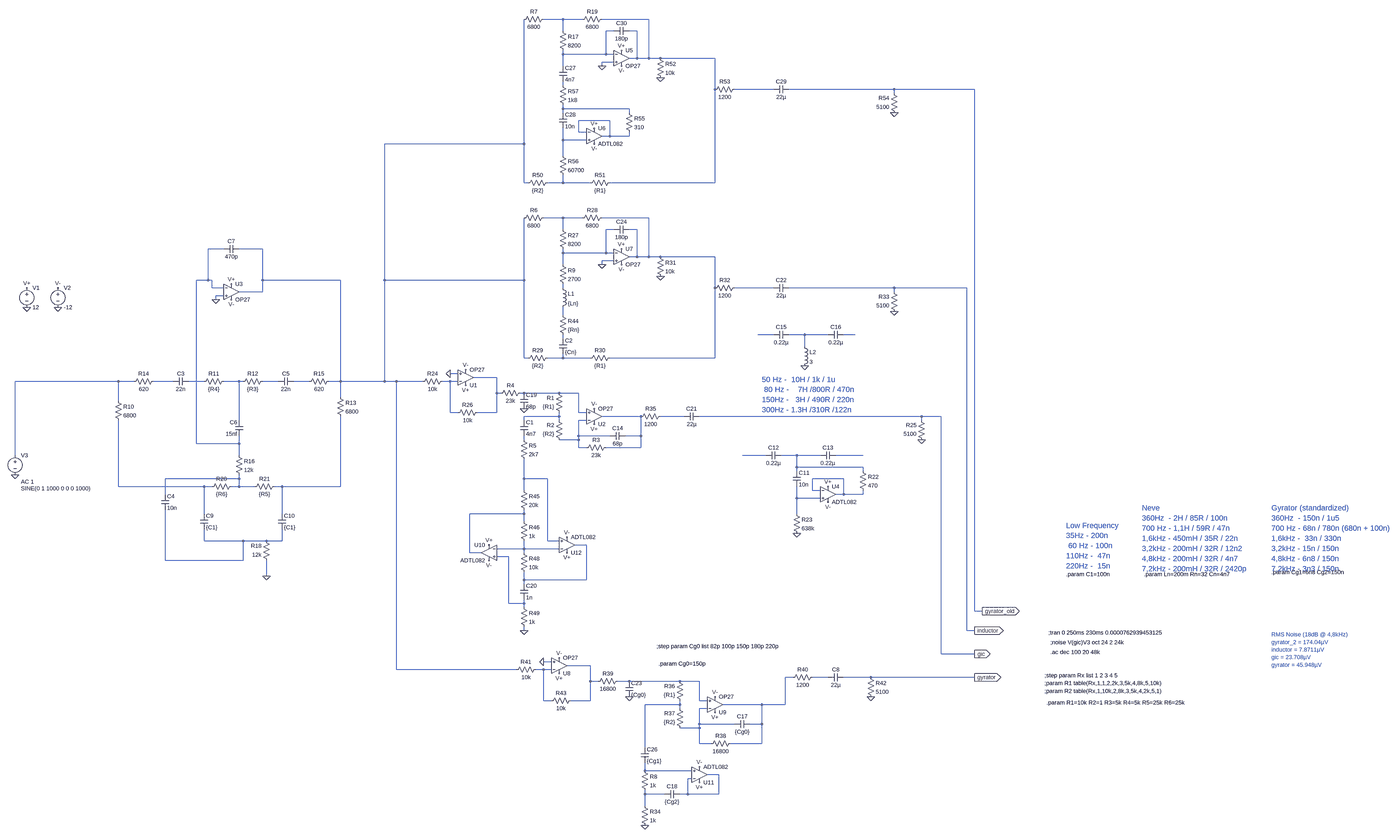
[diagram p0: schematic NYAN_1073_v2.asc, whole sheet]
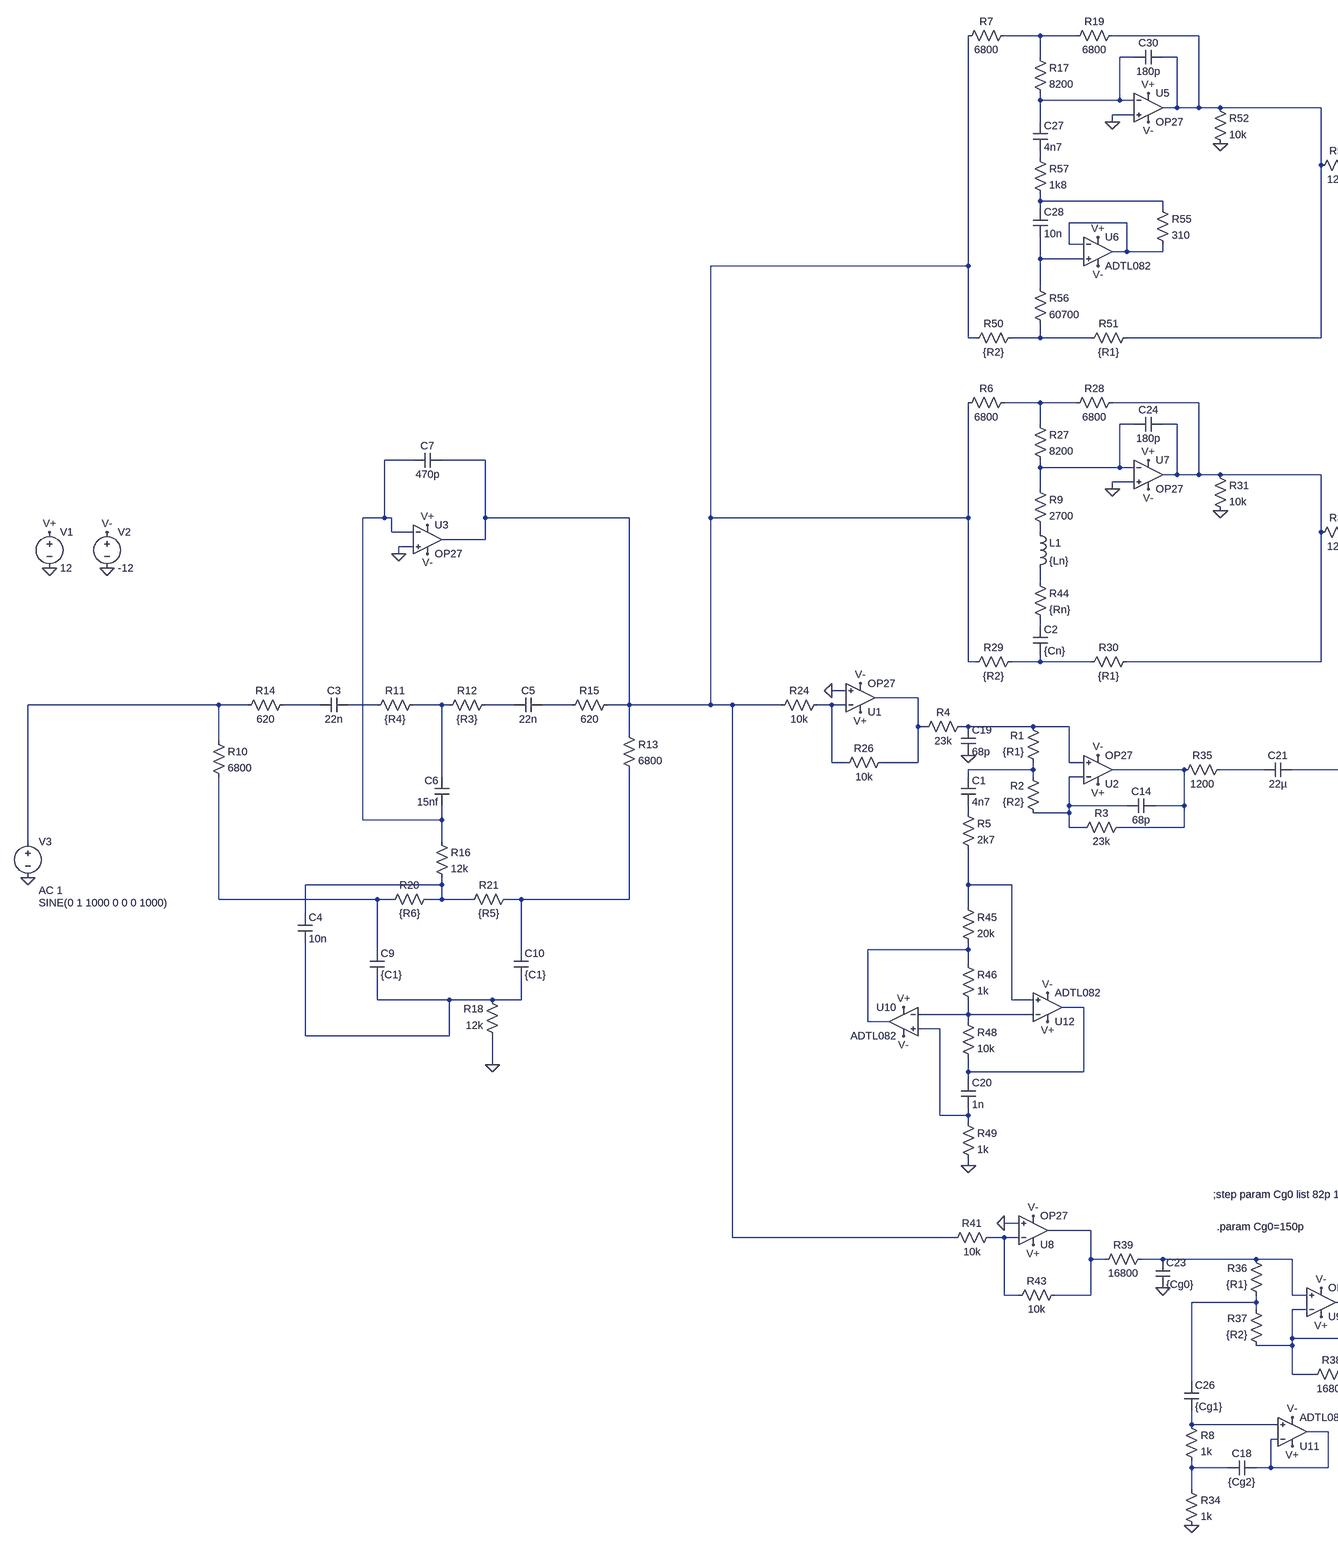
[diagram p1: schematic NYAN_1073_v2.asc, part, row 1 of 1, column 1 of 2]
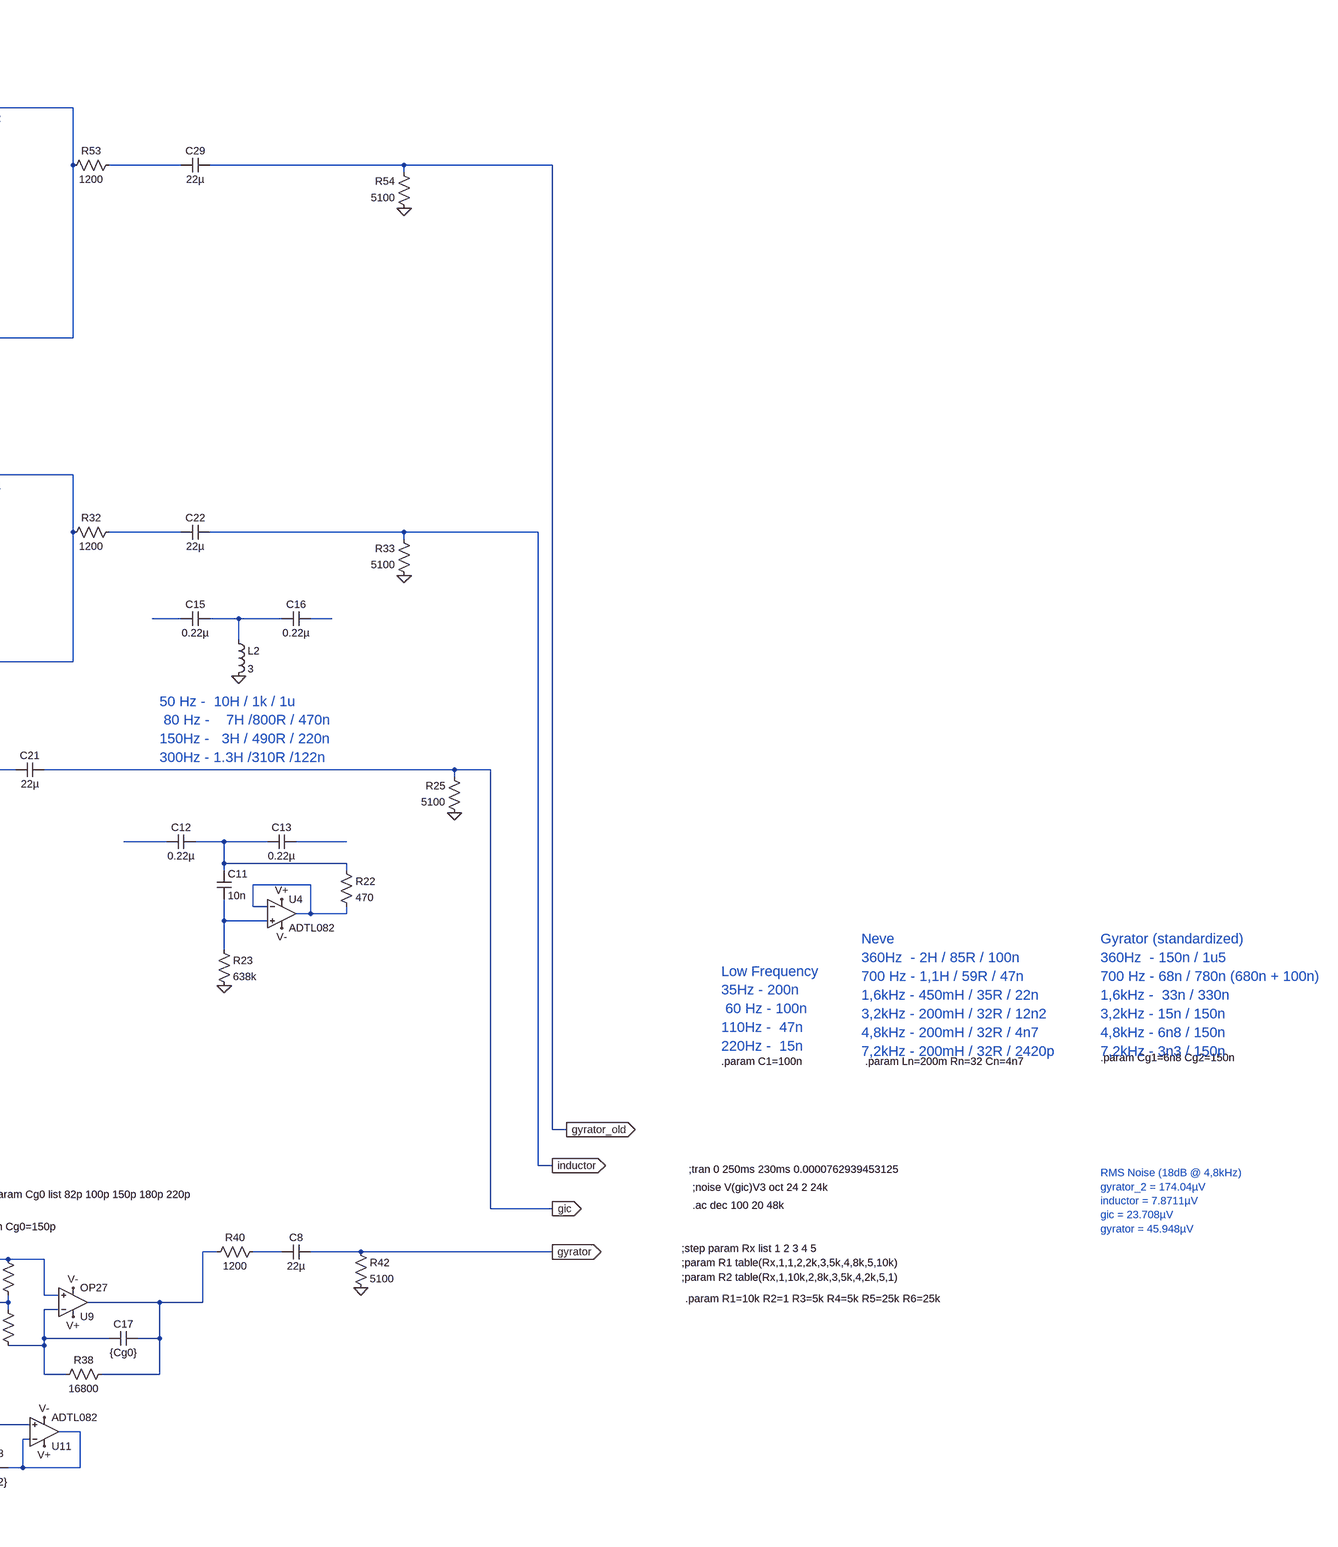
[diagram p2: schematic NYAN_1073_v2.asc, part, row 1 of 1, column 2 of 2]
NYAN_1073_v2.asc, the LTspice schematic file:
Version 4
SHEET 1 3984 2576
WIRE 288 -1104 208 -1104
WIRE 368 -1104 288 -1104
WIRE 640 -1104 448 -1104
WIRE 288 -1056 288 -1104
WIRE 496 -1056 464 -1056
WIRE 592 -1056 560 -1056
WIRE 288 -960 288 -976
WIRE 464 -960 464 -1056
WIRE 464 -960 288 -960
WIRE 496 -960 464 -960
WIRE 592 -944 592 -1056
WIRE 592 -944 560 -944
WIRE 640 -944 640 -1104
WIRE 640 -944 592 -944
WIRE 688 -944 640 -944
WIRE 912 -944 688 -944
WIRE 496 -928 448 -928
WIRE 288 -912 288 -960
WIRE 448 -912 448 -928
WIRE 288 -832 288 -848
WIRE 912 -816 912 -944
WIRE 1152 -816 992 -816
WIRE 1648 -816 1216 -816
WIRE 2176 -816 1648 -816
WIRE 1648 -800 1648 -816
WIRE 288 -736 288 -752
WIRE 560 -736 288 -736
WIRE 288 -720 288 -736
WIRE 560 -720 560 -736
WIRE 480 -688 352 -688
WIRE 352 -640 352 -688
WIRE 384 -640 352 -640
WIRE 480 -624 480 -688
WIRE 480 -624 448 -624
WIRE 560 -624 560 -640
WIRE 560 -624 480 -624
WIRE 288 -608 288 -656
WIRE 384 -608 288 -608
WIRE 128 -592 128 -1104
WIRE 128 -592 -448 -592
WIRE 288 -544 288 -608
WIRE 128 -432 128 -592
WIRE 144 -432 128 -432
WIRE 288 -432 288 -464
WIRE 288 -432 224 -432
WIRE 400 -432 288 -432
WIRE 912 -432 912 -816
WIRE 912 -432 480 -432
WIRE 288 -288 208 -288
WIRE 368 -288 288 -288
WIRE 640 -288 448 -288
WIRE 288 -240 288 -288
WIRE 496 -240 464 -240
WIRE 592 -240 560 -240
WIRE -1136 -160 -1200 -160
WIRE -976 -160 -1072 -160
WIRE 288 -144 288 -160
WIRE 464 -144 464 -240
WIRE 464 -144 288 -144
WIRE 496 -144 464 -144
WIRE 592 -128 592 -240
WIRE 592 -128 560 -128
WIRE 640 -128 640 -288
WIRE 640 -128 592 -128
WIRE 688 -128 640 -128
WIRE 912 -128 688 -128
WIRE 496 -112 448 -112
WIRE 288 -96 288 -144
WIRE 448 -96 448 -112
WIRE -1200 -32 -1200 -160
WIRE -1200 -32 -1248 -32
WIRE -1184 -32 -1200 -32
WIRE -976 -32 -976 -160
WIRE -656 -32 -976 -32
WIRE -448 -32 -448 -592
WIRE 128 -32 128 -288
WIRE 128 -32 -448 -32
WIRE -1184 0 -1184 -32
WIRE -1136 0 -1184 0
WIRE 288 0 288 -16
WIRE 912 0 912 -128
WIRE 1152 0 992 0
WIRE 1648 0 1216 0
WIRE 2144 0 1648 0
WIRE -976 16 -976 -32
WIRE -976 16 -1072 16
WIRE 1648 16 1648 0
WIRE -1136 32 -1168 32
WIRE -1168 48 -1168 32
WIRE 288 112 288 80
WIRE 1152 192 1088 192
WIRE 1280 192 1216 192
WIRE 1376 192 1280 192
WIRE 1488 192 1440 192
WIRE 288 208 288 192
WIRE 1280 240 1280 192
WIRE 128 288 128 -32
WIRE 144 288 128 288
WIRE 288 288 288 272
WIRE 288 288 224 288
WIRE 400 288 288 288
WIRE 912 288 912 0
WIRE 912 288 480 288
WIRE -144 352 -176 352
WIRE 16 368 -80 368
WIRE -1568 384 -2064 384
WIRE -1504 384 -1568 384
WIRE -1344 384 -1424 384
WIRE -1216 384 -1280 384
WIRE -1072 384 -1136 384
WIRE -1056 384 -1072 384
WIRE -912 384 -976 384
WIRE -784 384 -848 384
WIRE -656 384 -656 -32
WIRE -656 384 -704 384
WIRE -448 384 -448 -32
WIRE -448 384 -656 384
WIRE -400 384 -448 384
WIRE -288 384 -400 384
WIRE -176 384 -208 384
WIRE -144 384 -176 384
WIRE 16 432 16 368
WIRE 32 432 16 432
WIRE 128 432 112 432
WIRE 272 432 128 432
WIRE 352 432 272 432
WIRE -656 448 -656 384
WIRE -1568 464 -1568 384
WIRE -176 512 -176 384
WIRE -144 512 -176 512
WIRE 16 512 16 432
WIRE 16 512 -64 512
WIRE 352 512 352 432
WIRE 384 512 352 512
WIRE 272 528 272 512
WIRE 272 528 128 528
WIRE 608 528 448 528
WIRE 784 528 688 528
WIRE 1760 528 848 528
WIRE 1840 528 1760 528
WIRE -1072 544 -1072 384
WIRE 128 544 128 528
WIRE 272 544 272 528
WIRE 384 544 352 544
WIRE 1760 544 1760 528
WIRE 352 608 352 544
WIRE 480 608 352 608
WIRE 608 608 608 528
WIRE 608 608 544 608
WIRE 128 624 128 608
WIRE 352 624 352 608
WIRE 352 624 272 624
WIRE -1248 640 -1248 -32
WIRE -1072 640 -1072 608
WIRE -1072 640 -1248 640
WIRE 352 656 352 624
WIRE 384 656 352 656
WIRE 608 656 608 608
WIRE 608 656 464 656
WIRE -2064 688 -2064 384
WIRE -1072 688 -1072 640
WIRE 1120 688 1024 688
WIRE 1248 688 1184 688
WIRE 1344 688 1248 688
WIRE 1520 688 1408 688
WIRE 1248 736 1248 688
WIRE 1520 736 1248 736
WIRE 1248 752 1248 736
WIRE 1520 752 1520 736
WIRE -1072 784 -1072 768
WIRE -1072 784 -1376 784
WIRE 128 784 128 704
WIRE 224 784 128 784
WIRE 1440 784 1312 784
WIRE -1568 816 -1568 544
WIRE -1216 816 -1568 816
WIRE -1184 816 -1216 816
WIRE -1072 816 -1072 784
WIRE -1072 816 -1104 816
WIRE -1008 816 -1072 816
WIRE -896 816 -928 816
WIRE -656 816 -656 528
WIRE -656 816 -896 816
WIRE 128 832 128 784
WIRE 1312 832 1312 784
WIRE 1344 832 1312 832
WIRE -1376 848 -1376 784
WIRE 1440 848 1440 784
WIRE 1440 848 1408 848
WIRE 1520 848 1520 832
WIRE 1520 848 1440 848
WIRE 1248 864 1248 816
WIRE 1344 864 1248 864
WIRE -1216 928 -1216 816
WIRE -896 928 -896 816
WIRE 128 928 128 912
WIRE 128 928 -96 928
WIRE 1248 928 1248 864
WIRE 128 960 128 928
WIRE -1216 1040 -1216 992
WIRE -1056 1040 -1216 1040
WIRE -960 1040 -1056 1040
WIRE -896 1040 -896 992
WIRE -896 1040 -960 1040
WIRE 224 1040 224 784
WIRE 272 1040 224 1040
WIRE 384 1056 336 1056
WIRE 128 1072 128 1040
WIRE 128 1072 16 1072
WIRE 272 1072 128 1072
WIRE -96 1088 -96 928
WIRE -48 1088 -96 1088
WIRE 128 1088 128 1072
WIRE 64 1104 16 1104
WIRE -1376 1120 -1376 912
WIRE -1056 1120 -1056 1040
WIRE -1056 1120 -1376 1120
WIRE -960 1184 -960 1120
WIRE 128 1200 128 1168
WIRE 384 1200 384 1056
WIRE 384 1200 128 1200
WIRE 128 1216 128 1200
WIRE 64 1296 64 1104
WIRE 128 1296 128 1280
WIRE 128 1296 64 1296
WIRE 128 1312 128 1296
WIRE 2176 1328 2176 -816
WIRE 2208 1328 2176 1328
WIRE 128 1408 128 1392
WIRE 2144 1408 2144 0
WIRE 2176 1408 2144 1408
WIRE 1840 1504 1840 528
WIRE 2176 1504 1840 1504
WIRE 240 1536 208 1536
WIRE 400 1552 304 1552
WIRE -400 1568 -400 384
WIRE 96 1568 -400 1568
WIRE 208 1568 176 1568
WIRE 240 1568 208 1568
WIRE 1232 1600 1200 1600
WIRE 1376 1600 1312 1600
WIRE 1552 1600 1440 1600
WIRE 2176 1600 1552 1600
WIRE 400 1616 400 1552
WIRE 432 1616 400 1616
WIRE 560 1616 512 1616
WIRE 768 1616 560 1616
WIRE 848 1616 768 1616
WIRE 208 1696 208 1568
WIRE 240 1696 208 1696
WIRE 400 1696 400 1616
WIRE 400 1696 320 1696
WIRE 848 1696 848 1616
WIRE 880 1696 848 1696
WIRE 768 1712 768 1696
WIRE 768 1712 624 1712
WIRE 1104 1712 944 1712
WIRE 1200 1712 1200 1600
WIRE 1200 1712 1104 1712
WIRE 768 1728 768 1712
WIRE 880 1728 848 1728
WIRE 848 1792 848 1728
WIRE 992 1792 848 1792
WIRE 1104 1792 1104 1712
WIRE 1104 1792 1056 1792
WIRE 848 1808 848 1792
WIRE 848 1808 768 1808
WIRE 848 1872 848 1808
WIRE 896 1872 848 1872
WIRE 1104 1872 1104 1792
WIRE 1104 1872 976 1872
WIRE 624 1888 624 1712
WIRE 624 1984 624 1952
WIRE 816 1984 624 1984
WIRE 928 2000 880 2000
WIRE 816 2016 800 2016
WIRE 624 2080 624 2064
WIRE 704 2080 624 2080
WIRE 800 2080 800 2016
WIRE 800 2080 768 2080
WIRE 928 2080 928 2000
WIRE 928 2080 800 2080
WIRE 624 2128 624 2080
FLAG -2016 80 0
FLAG -2016 0 V+
FLAG -1888 80 0
FLAG -1888 0 V-
FLAG -2064 768 0
FLAG -1168 48 0
FLAG -1104 -16 V+
FLAG -1104 48 V-
FLAG -960 1184 0
FLAG 1376 816 V+
FLAG 1376 880 V-
FLAG 1248 1008 0
FLAG 1760 624 0
FLAG 2176 1504 gic
IOPIN 2176 1504 Out
FLAG 416 560 V+
FLAG 416 496 V-
FLAG -112 400 V+
FLAG -112 336 V-
FLAG -176 352 0
FLAG 448 -96 0
FLAG 528 -160 V+
FLAG 528 -96 V-
FLAG 688 -48 0
FLAG 2176 1408 inductor
IOPIN 2176 1408 Out
FLAG 1648 96 0
FLAG 1280 320 0
FLAG 2176 1600 gyrator
IOPIN 2176 1600 Out
FLAG 912 1744 V+
FLAG 912 1680 V-
FLAG 272 1584 V+
FLAG 272 1520 V-
FLAG 208 1536 0
FLAG 848 2032 V+
FLAG 848 1968 V-
FLAG 128 496 0
FLAG -16 1056 V+
FLAG -16 1120 V-
FLAG 304 1088 V+
FLAG 304 1024 V-
FLAG 128 1408 0
FLAG 448 -912 0
FLAG 528 -976 V+
FLAG 528 -912 V-
FLAG 688 -864 0
FLAG 2208 1328 gyrator_old
IOPIN 2208 1328 Out
FLAG 1648 -720 0
FLAG 416 -656 V+
FLAG 416 -592 V-
FLAG 624 2208 0
FLAG 1552 1680 0
FLAG 560 1680 0
SYMBOL voltage -2016 -16 R0
WINDOW 123 0 0 Left 0
WINDOW 39 0 0 Left 0
SYMATTR InstName V1
SYMATTR Value 12
SYMBOL voltage -1888 -16 R0
WINDOW 123 0 0 Left 0
WINDOW 39 0 0 Left 0
SYMATTR InstName V2
SYMATTR Value -12
SYMBOL voltage -2064 672 R0
WINDOW 3 24 152 Left 2
WINDOW 123 24 124 Left 2
WINDOW 39 0 0 Left 0
SYMATTR Value SINE(0 1 1000 0 0 0 1000)
SYMATTR Value2 AC 1
SYMATTR InstName V3
SYMBOL res -1120 368 R90
WINDOW 0 0 56 VBottom 2
WINDOW 3 32 56 VTop 2
SYMATTR InstName R11
SYMATTR Value {R4}
SYMBOL res -960 368 R90
WINDOW 0 0 56 VBottom 2
WINDOW 3 32 56 VTop 2
SYMATTR InstName R12
SYMATTR Value {R3}
SYMBOL cap -1280 368 R90
WINDOW 0 0 32 VBottom 2
WINDOW 3 32 32 VTop 2
SYMATTR InstName C3
SYMATTR Value 22n
SYMBOL cap -848 368 R90
WINDOW 0 0 32 VBottom 2
WINDOW 3 32 32 VTop 2
SYMATTR InstName C5
SYMATTR Value 22n
SYMBOL cap -1056 608 R180
WINDOW 0 24 56 Left 2
WINDOW 3 24 8 Left 2
SYMATTR InstName C6
SYMATTR Value 15nf
SYMBOL res -1584 448 R0
SYMATTR InstName R10
SYMATTR Value 6800
SYMATTR SpiceLine tol=1 pwr=0.25
SYMBOL res -672 432 R0
SYMATTR InstName R13
SYMATTR Value 6800
SYMBOL res -1408 368 R90
WINDOW 0 0 56 VBottom 2
WINDOW 3 32 56 VTop 2
SYMATTR InstName R14
SYMATTR Value 620
SYMBOL res -688 368 R90
WINDOW 0 0 56 VBottom 2
WINDOW 3 32 56 VTop 2
SYMATTR InstName R15
SYMATTR Value 620
SYMBOL res -1088 672 R0
SYMATTR InstName R16
SYMATTR Value 12k
SYMBOL res -944 1136 R180
WINDOW 0 36 76 Left 2
WINDOW 3 36 40 Left 2
SYMATTR InstName R18
SYMATTR Value 12k
SYMBOL cap -1392 848 R0
SYMATTR InstName C4
SYMATTR Value 10n
SYMBOL res -1088 800 R90
WINDOW 0 0 56 VBottom 2
WINDOW 3 32 56 VTop 2
SYMATTR InstName R20
SYMATTR Value {R6}
SYMBOL res -912 800 R90
WINDOW 0 0 56 VBottom 2
WINDOW 3 32 56 VTop 2
SYMATTR InstName R21
SYMATTR Value {R5}
SYMBOL cap -1232 928 R0
SYMATTR InstName C9
SYMATTR Value {C1}
SYMBOL cap -912 928 R0
SYMATTR InstName C10
SYMATTR Value {C1}
SYMBOL Opamps\\ADTL082 1376 784 R0
SYMATTR InstName U4
SYMBOL cap 1232 752 R0
SYMATTR InstName C11
SYMATTR Value 10n
SYMATTR SpiceLine V=63
SYMBOL res 1504 736 R0
SYMATTR InstName R22
SYMATTR Value 470
SYMATTR SpiceLine tol=1 pwr=0.25
SYMBOL res 1232 912 R0
SYMATTR InstName R23
SYMATTR Value 638k
SYMATTR SpiceLine tol=1 pwr=0.25
SYMBOL res 1776 640 R180
WINDOW 0 36 76 Left 2
WINDOW 3 36 40 Left 2
SYMATTR InstName R25
SYMATTR Value 5100
SYMBOL cap 1184 672 R90
WINDOW 0 0 32 VBottom 2
WINDOW 3 32 32 VTop 2
SYMATTR InstName C12
SYMATTR Value 0.22µ
SYMBOL cap 1408 672 R90
WINDOW 0 0 32 VBottom 2
WINDOW 3 32 32 VTop 2
SYMATTR InstName C13
SYMATTR Value 0.22µ
SYMBOL res 704 512 R90
WINDOW 0 0 56 VBottom 2
WINDOW 3 32 56 VTop 2
SYMATTR InstName R35
SYMATTR Value 1200
SYMBOL res 288 528 R180
WINDOW 0 36 76 Left 2
WINDOW 3 36 40 Left 2
SYMATTR InstName R1
SYMATTR Value {R1}
SYMATTR SpiceLine tol=1 pwr=0.25
SYMBOL res 288 640 R180
WINDOW 0 36 76 Left 2
WINDOW 3 36 40 Left 2
SYMATTR InstName R2
SYMATTR Value {R2}
SYMATTR SpiceLine tol=1 pwr=0.25
SYMBOL res 480 640 R90
WINDOW 0 0 56 VBottom 2
WINDOW 3 32 56 VTop 2
SYMATTR InstName R3
SYMATTR Value 23k
SYMBOL res 128 416 R90
WINDOW 0 0 56 VBottom 2
WINDOW 3 32 56 VTop 2
SYMATTR InstName R4
SYMATTR Value 23k
SYMBOL cap 112 544 R0
SYMATTR InstName C1
SYMATTR Value 4n7
SYMATTR SpiceLine V=63
SYMBOL OpAmps\\OP27 -112 432 M180
SYMATTR InstName U1
SYMBOL OpAmps\\OP27 416 592 M180
SYMATTR InstName U2
SYMBOL res -192 368 R90
WINDOW 0 0 56 VBottom 2
WINDOW 3 32 56 VTop 2
SYMATTR InstName R24
SYMATTR Value 10k
SYMBOL res -48 496 R90
WINDOW 0 0 56 VBottom 2
WINDOW 3 32 56 VTop 2
SYMATTR InstName R26
SYMATTR Value 10k
SYMBOL OpAmps\\OP27 -1104 -48 R0
SYMATTR InstName U3
SYMBOL res 224 -304 R90
WINDOW 0 0 56 VBottom 2
WINDOW 3 32 56 VTop 2
SYMATTR InstName R6
SYMATTR Value 6800
SYMATTR SpiceLine tol=1 pwr=0.25
SYMBOL res 272 -112 R0
SYMATTR InstName R9
SYMATTR Value 2700
SYMATTR SpiceLine tol=1 pwr=0.25
SYMBOL res 272 -256 R0
SYMATTR InstName R27
SYMATTR Value 8200
SYMATTR SpiceLine tol=1 pwr=0.25
SYMBOL cap 272 208 R0
SYMATTR InstName C2
SYMATTR Value {Cn}
SYMATTR SpiceLine V=63
SYMBOL res 464 -304 R90
WINDOW 0 0 56 VBottom 2
WINDOW 3 32 56 VTop 2
SYMATTR InstName R28
SYMATTR Value 6800
SYMATTR SpiceLine tol=1 pwr=0.25
SYMBOL res 240 272 R90
WINDOW 0 0 56 VBottom 2
WINDOW 3 32 56 VTop 2
SYMATTR InstName R29
SYMATTR Value {R2}
SYMATTR SpiceLine tol=1 pwr=0.25
SYMBOL res 496 272 R90
WINDOW 0 0 56 VBottom 2
WINDOW 3 32 56 VTop 2
SYMATTR InstName R30
SYMATTR Value {R1}
SYMATTR SpiceLine tol=1 pwr=0.25
SYMBOL res 672 -144 R0
SYMATTR InstName R31
SYMATTR Value 10k
SYMBOL res 1008 -16 R90
WINDOW 0 0 56 VBottom 2
WINDOW 3 32 56 VTop 2
SYMATTR InstName R32
SYMATTR Value 1200
SYMBOL ind 272 -16 R0
SYMATTR InstName L1
SYMATTR Value {Ln}
SYMATTR SpiceLine Rser=0
SYMBOL OpAmps\\OP27 528 -192 R0
SYMATTR InstName U7
SYMBOL res 1664 112 R180
WINDOW 0 36 76 Left 2
WINDOW 3 36 40 Left 2
SYMATTR InstName R33
SYMATTR Value 5100
SYMBOL cap 1216 176 R90
WINDOW 0 0 32 VBottom 2
WINDOW 3 32 32 VTop 2
SYMATTR InstName C15
SYMATTR Value 0.22µ
SYMBOL cap 1440 176 R90
WINDOW 0 0 32 VBottom 2
WINDOW 3 32 32 VTop 2
SYMATTR InstName C16
SYMATTR Value 0.22µ
SYMBOL ind 1264 224 R0
SYMATTR InstName L2
SYMATTR Value 3
SYMATTR SpiceLine Rser=490
SYMBOL cap -1072 -176 R90
WINDOW 0 0 32 VBottom 2
WINDOW 3 32 32 VTop 2
SYMATTR InstName C7
SYMATTR Value 470p
SYMBOL res 784 1712 R180
WINDOW 0 36 76 Left 2
WINDOW 3 36 40 Left 2
SYMATTR InstName R36
SYMATTR Value {R1}
SYMATTR SpiceLine tol=1 pwr=0.25
SYMBOL res 784 1824 R180
WINDOW 0 36 76 Left 2
WINDOW 3 36 40 Left 2
SYMATTR InstName R37
SYMATTR Value {R2}
SYMATTR SpiceLine tol=1 pwr=0.25
SYMBOL res 992 1856 R90
WINDOW 0 0 56 VBottom 2
WINDOW 3 32 56 VTop 2
SYMATTR InstName R38
SYMATTR Value 16800
SYMBOL res 528 1600 R90
WINDOW 0 0 56 VBottom 2
WINDOW 3 32 56 VTop 2
SYMATTR InstName R39
SYMATTR Value 16800
SYMBOL OpAmps\\OP27 272 1616 M180
SYMATTR InstName U8
SYMBOL OpAmps\\OP27 912 1776 M180
SYMATTR InstName U9
SYMBOL res 192 1552 R90
WINDOW 0 0 56 VBottom 2
WINDOW 3 32 56 VTop 2
SYMATTR InstName R41
SYMATTR Value 10k
SYMBOL res 336 1680 R90
WINDOW 0 0 56 VBottom 2
WINDOW 3 32 56 VTop 2
SYMATTR InstName R43
SYMATTR Value 10k
SYMBOL Opamps\\ADTL082 848 2064 M180
SYMATTR InstName U11
SYMBOL res 112 608 R0
SYMATTR InstName R5
SYMATTR Value 2k7
SYMBOL cap 848 512 R90
WINDOW 0 0 32 VBottom 2
WINDOW 3 32 32 VTop 2
SYMATTR InstName C21
SYMATTR Value 22µ
SYMBOL cap 1216 -16 R90
WINDOW 0 0 32 VBottom 2
WINDOW 3 32 32 VTop 2
SYMATTR InstName C22
SYMATTR Value 22µ
SYMBOL Opamps\\ADTL082 -16 1024 M0
SYMATTR InstName U10
SYMBOL Opamps\\ADTL082 304 1120 M180
SYMATTR InstName U12
SYMBOL res 112 816 R0
SYMATTR InstName R45
SYMATTR Value 20k
SYMBOL res 112 944 R0
SYMATTR InstName R46
SYMATTR Value 1k
SYMBOL res 112 1072 R0
SYMATTR InstName R48
SYMATTR Value 10k
SYMBOL cap 112 1216 R0
SYMATTR InstName C20
SYMATTR Value 1n
SYMBOL res 112 1296 R0
SYMATTR InstName R49
SYMATTR Value 1k
SYMBOL res 224 -1120 R90
WINDOW 0 0 56 VBottom 2
WINDOW 3 32 56 VTop 2
SYMATTR InstName R7
SYMATTR Value 6800
SYMATTR SpiceLine tol=1 pwr=0.25
SYMBOL res 272 -1072 R0
SYMATTR InstName R17
SYMATTR Value 8200
SYMATTR SpiceLine tol=1 pwr=0.25
SYMBOL res 464 -1120 R90
WINDOW 0 0 56 VBottom 2
WINDOW 3 32 56 VTop 2
SYMATTR InstName R19
SYMATTR Value 6800
SYMATTR SpiceLine tol=1 pwr=0.25
SYMBOL res 240 -448 R90
WINDOW 0 0 56 VBottom 2
WINDOW 3 32 56 VTop 2
SYMATTR InstName R50
SYMATTR Value {R2}
SYMATTR SpiceLine tol=1 pwr=0.25
SYMBOL res 496 -448 R90
WINDOW 0 0 56 VBottom 2
WINDOW 3 32 56 VTop 2
SYMATTR InstName R51
SYMATTR Value {R1}
SYMATTR SpiceLine tol=1 pwr=0.25
SYMBOL res 672 -960 R0
SYMATTR InstName R52
SYMATTR Value 10k
SYMBOL res 1008 -832 R90
WINDOW 0 0 56 VBottom 2
WINDOW 3 32 56 VTop 2
SYMATTR InstName R53
SYMATTR Value 1200
SYMBOL OpAmps\\OP27 528 -1008 R0
SYMATTR InstName U5
SYMBOL res 1664 -704 R180
WINDOW 0 36 76 Left 2
WINDOW 3 36 40 Left 2
SYMATTR InstName R54
SYMATTR Value 5100
SYMBOL cap 1216 -832 R90
WINDOW 0 0 32 VBottom 2
WINDOW 3 32 32 VTop 2
SYMATTR InstName C29
SYMATTR Value 22µ
SYMBOL cap 560 -1072 R90
WINDOW 0 0 32 VBottom 2
WINDOW 3 32 32 VTop 2
SYMATTR InstName C30
SYMATTR Value 180p
SYMBOL cap 272 -912 R0
SYMATTR InstName C27
SYMATTR Value 4n7
SYMATTR SpiceLine V=63
SYMBOL Opamps\\ADTL082 416 -688 R0
SYMATTR InstName U6
SYMBOL cap 272 -720 R0
SYMATTR InstName C28
SYMATTR Value 10n
SYMATTR SpiceLine V=63
SYMBOL res 544 -736 R0
SYMATTR InstName R55
SYMATTR Value 310
SYMATTR SpiceLine tol=1 pwr=0.25
SYMBOL res 272 -560 R0
SYMATTR InstName R56
SYMATTR Value 60700
SYMATTR SpiceLine tol=1 pwr=0.25
SYMBOL res 272 -848 R0
SYMATTR InstName R57
SYMATTR Value 1k8
SYMBOL cap 544 592 R90
WINDOW 0 0 32 VBottom 2
WINDOW 3 32 32 VTop 2
SYMATTR InstName C14
SYMATTR Value 68p
SYMBOL cap 112 432 R0
SYMATTR InstName C19
SYMATTR Value 68p
SYMBOL cap 768 2064 R90
WINDOW 0 0 32 VBottom 2
WINDOW 3 32 32 VTop 2
SYMATTR InstName C18
SYMATTR Value {Cg2}
SYMBOL res 608 1968 R0
SYMATTR InstName R8
SYMATTR Value 1k
SYMBOL res 608 2112 R0
SYMATTR InstName R34
SYMATTR Value 1k
SYMBOL cap 608 1888 R0
SYMATTR InstName C26
SYMATTR Value {Cg1}
SYMBOL res 1328 1584 R90
WINDOW 0 0 56 VBottom 2
WINDOW 3 32 56 VTop 2
SYMATTR InstName R40
SYMATTR Value 1200
SYMBOL cap 1440 1584 R90
WINDOW 0 0 32 VBottom 2
WINDOW 3 32 32 VTop 2
SYMATTR InstName C8
SYMATTR Value 22µ
SYMBOL res 1536 1584 R0
SYMATTR InstName R42
SYMATTR Value 5100
SYMBOL cap 560 -256 R90
WINDOW 0 0 32 VBottom 2
WINDOW 3 32 32 VTop 2
SYMATTR InstName C24
SYMATTR Value 180p
SYMBOL res 272 96 R0
SYMATTR InstName R44
SYMATTR Value {Rn}
SYMBOL cap 1056 1776 R90
WINDOW 0 0 32 VBottom 2
WINDOW 3 32 32 VTop 2
SYMATTR InstName C17
SYMATTR Value {Cg0}
SYMBOL cap 544 1616 R0
SYMATTR InstName C23
SYMATTR Value {Cg0}
TEXT 2496 1496 Left 2 !.ac dec 100 20 48k
TEXT 2488 1416 Left 2 !;tran 0 250ms 230ms 0.0000762939453125
TEXT 2496 1456 Left 2 !;noise V(gic)V3 oct 24 2 24k
TEXT 2560 976 Left 3 ;Low Frequency\n35Hz - 200n\n 60 Hz - 100n\n110Hz -  47n\n220Hz -  15n
TEXT 1104 376 Left 3 ;50 Hz -  10H / 1k / 1u\n 80 Hz -    7H /800R / 470n\n150Hz -   3H / 490R / 220n\n300Hz - 1.3H /310R /122n
TEXT 2472 1592 Left 2 !;step param Rx list 1 2 3 4 5
TEXT 2472 1624 Left 2 !;param R1 table(Rx,1,1,2,2k,3,5k,4,8k,5,10k)
TEXT 2472 1656 Left 2 !;param R2 table(Rx,1,10k,2,8k,3,5k,4,2k,5,1)
TEXT 2880 1176 Left 2 !.param Ln=200m Rn=32 Cn=4n7
TEXT 2872 904 Left 3 ;Neve\n360Hz  - 2H / 85R / 100n\n700 Hz - 1,1H / 59R / 47n\n1,6kHz - 450mH / 35R / 22n\n3,2kHz - 200mH / 32R / 12n2\n4,8kHz - 200mH / 32R / 4n7\n7,2kHz - 200mH / 32R / 2420p
TEXT 3432 1168 Left 2 !.param Cg1=6n8 Cg2=150n
TEXT 2480 1704 Left 2 !.param R1=10k R2=1 R3=5k R4=5k R5=25k R6=25k
TEXT 680 1544 Left 2 !.param Cg0=150p
TEXT 3432 1424 Left 2 ;RMS Noise (18dB @ 4,8kHz)\ngyrator_2 = 174.04µV\ninductor = 7.8711µV\ngic = 23.708µV\ngyrator = 45.948µV
TEXT 2560 1176 Left 2 !.param C1=100n
TEXT 3432 904 Left 3 ;Gyrator (standardized)\n360Hz  - 150n / 1u5\n700 Hz - 68n / 780n (680n + 100n)\n1,6kHz -  33n / 330n\n3,2kHz - 15n / 150n\n4,8kHz - 6n8 / 150n\n7,2kHz - 3n3 / 150n
TEXT 672 1472 Left 2 !;step param Cg0 list 82p 100p 150p 180p 220p

The netlist it stands for:
* NYAN_1073_v2.asc
V1 V+ 0 12
V2 V- 0 -12
V3 N024 0 SINE(0 1 1000 0 0 0 1000) AC 1
R11 N027 N026 {R4}
R12 N028 N027 {R3}
C3 N026 N025 22n
C5 N029 N028 22n
C6 N014 N027 15nf
R10 N024 N043 6800 tol=1 pwr=0.25
R13 N009 N044 6800
R14 N025 N024 620
R15 N009 N029 620
R16 N014 N040 12k
R18 0 N047 12k
C4 N040 N047 10n
R20 N040 N043 {R6}
R21 N044 N040 {R5}
C9 N043 N047 {C1}
C10 N044 N047 {C1}
XU4 N045 N042 V+ V- N042 ADTL082  ; pins In+ In- V+ V- OUT
C11 N038 N045 10n V=63
R22 N038 N042 470 tol=1 pwr=0.25
R23 N045 0 638k tol=1 pwr=0.25
R25 0 gic 5100
C12 N038 N037 0.22µ
C13 N039 N038 0.22µ
R35 N034 N033 1200
R1 N032 N031 {R1} tol=1 pwr=0.25
R2 N035 N032 {R2} tol=1 pwr=0.25
R3 N033 N035 23k
R4 N031 N023 23k
C1 N032 N036 4n7 V=63
XU1 0 N030 V+ V- N023 OP27  ; pins In+ In- V+ V- OUT
XU2 N031 N035 V+ V- N033 OP27  ; pins In+ In- V+ V- OUT
R24 N030 N009 10k
R26 N023 N030 10k
XU3 0 N014 V+ V- N009 OP27  ; pins In+ In- V+ V- OUT
R6 N011 N009 6800 tol=1 pwr=0.25
R9 N013 N015 2700 tol=1 pwr=0.25
R27 N011 N013 8200 tol=1 pwr=0.25
C2 N021 N022 {Cn} V=63
R28 N012 N011 6800 tol=1 pwr=0.25
R29 N022 N009 {R2} tol=1 pwr=0.25
R30 N012 N022 {R1} tol=1 pwr=0.25
R31 N012 0 10k
R32 N016 N012 1200
L1 N015 N017 {Ln} Rser=0
XU7 0 N013 V+ V- N012 OP27  ; pins In+ In- V+ V- OUT
R33 0 inductor 5100
C15 N019 N018 0.22µ
C16 N020 N019 0.22µ
L2 N019 0 3 Rser=490
C7 N009 N014 470p
R36 N056 N055 {R1} tol=1 pwr=0.25
R37 N057 N056 {R2} tol=1 pwr=0.25
R38 N053 N057 16800
R39 N055 N051 16800
XU8 0 N052 V+ V- N051 OP27  ; pins In+ In- V+ V- OUT
XU9 N055 N057 V+ V- N053 OP27  ; pins In+ In- V+ V- OUT
R41 N052 N009 10k
R43 N051 N052 10k
XU11 N058 N059 V+ V- N059 ADTL082  ; pins In+ In- V+ V- OUT
R5 N036 N041 2k7
C21 gic N034 22µ
C22 inductor N016 22µ
XU10 N050 N049 V+ V- N046 ADTL082  ; pins In+ In- V+ V- OUT
XU12 N041 N049 V+ V- N048 ADTL082  ; pins In+ In- V+ V- OUT
R45 N041 N046 20k
R46 N046 N049 1k
R48 N049 N048 10k
C20 N048 N050 1n
R49 N050 0 1k
R7 N001 N009 6800 tol=1 pwr=0.25
R17 N001 N003 8200 tol=1 pwr=0.25
R19 N002 N001 6800 tol=1 pwr=0.25
R50 N010 N009 {R2} tol=1 pwr=0.25
R51 N002 N010 {R1} tol=1 pwr=0.25
R52 N002 0 10k
R53 N005 N002 1200
XU5 0 N003 V+ V- N002 OP27  ; pins In+ In- V+ V- OUT
R54 0 gyrator_old 5100
C29 gyrator_old N005 22µ
C30 N002 N003 180p
C27 N003 N004 4n7 V=63
XU6 N008 N007 V+ V- N007 ADTL082  ; pins In+ In- V+ V- OUT
C28 N006 N008 10n V=63
R55 N006 N007 310 tol=1 pwr=0.25
R56 N008 N010 60700 tol=1 pwr=0.25
R57 N004 N006 1k8
C14 N033 N035 68p
C19 N031 0 68p
C18 N059 N060 {Cg2}
R8 N058 N060 1k
R34 N060 0 1k
C26 N056 N058 {Cg1}
R40 N054 N053 1200
C8 gyrator N054 22µ
R42 gyrator 0 5100
C24 N012 N013 180p
R44 N017 N021 {Rn}
C17 N053 N057 {Cg0}
C23 N055 0 {Cg0}
.ac dec 100 20 48k
;tran 0 250ms 230ms 0.0000762939453125
;noise V(gic)V3 oct 24 2 24k
* Low Frequency
* 35Hz - 200n
*  60 Hz - 100n
* 110Hz -  47n
* 220Hz -  15n
* 50 Hz -  10H / 1k / 1u
*  80 Hz -    7H /800R / 470n
* 150Hz -   3H / 490R / 220n
* 300Hz - 1.3H /310R /122n
;step param Rx list 1 2 3 4 5
;param R1 table(Rx,1,1,2,2k,3,5k,4,8k,5,10k)
;param R2 table(Rx,1,10k,2,8k,3,5k,4,2k,5,1)
.param Ln=200m Rn=32 Cn=4n7
* Neve
* 360Hz  - 2H / 85R / 100n
* 700 Hz - 1,1H / 59R / 47n
* 1,6kHz - 450mH / 35R / 22n
* 3,2kHz - 200mH / 32R / 12n2
* 4,8kHz - 200mH / 32R / 4n7
* 7,2kHz - 200mH / 32R / 2420p
.param Cg1=6n8 Cg2=150n
.param R1=10k R2=1 R3=5k R4=5k R5=25k R6=25k
.param Cg0=150p
* RMS Noise (18dB @ 4,8kHz)
* gyrator_2 = 174.04µV
* inductor = 7.8711µV
* gic = 23.708µV
* gyrator = 45.948µV
.param C1=100n
* Gyrator (standardized)
* 360Hz  - 150n / 1u5
* 700 Hz - 68n / 780n (680n + 100n)
* 1,6kHz -  33n / 330n
* 3,2kHz - 15n / 150n
* 4,8kHz - 6n8 / 150n
* 7,2kHz - 3n3 / 150n
;step param Cg0 list 82p 100p 150p 180p 220p
.lib ADI.lib
.backanno
.end